# EAGLE design OSO-BOOK-C1-00 (EAGLE 9.6.2)

## Sheet 1 of 2
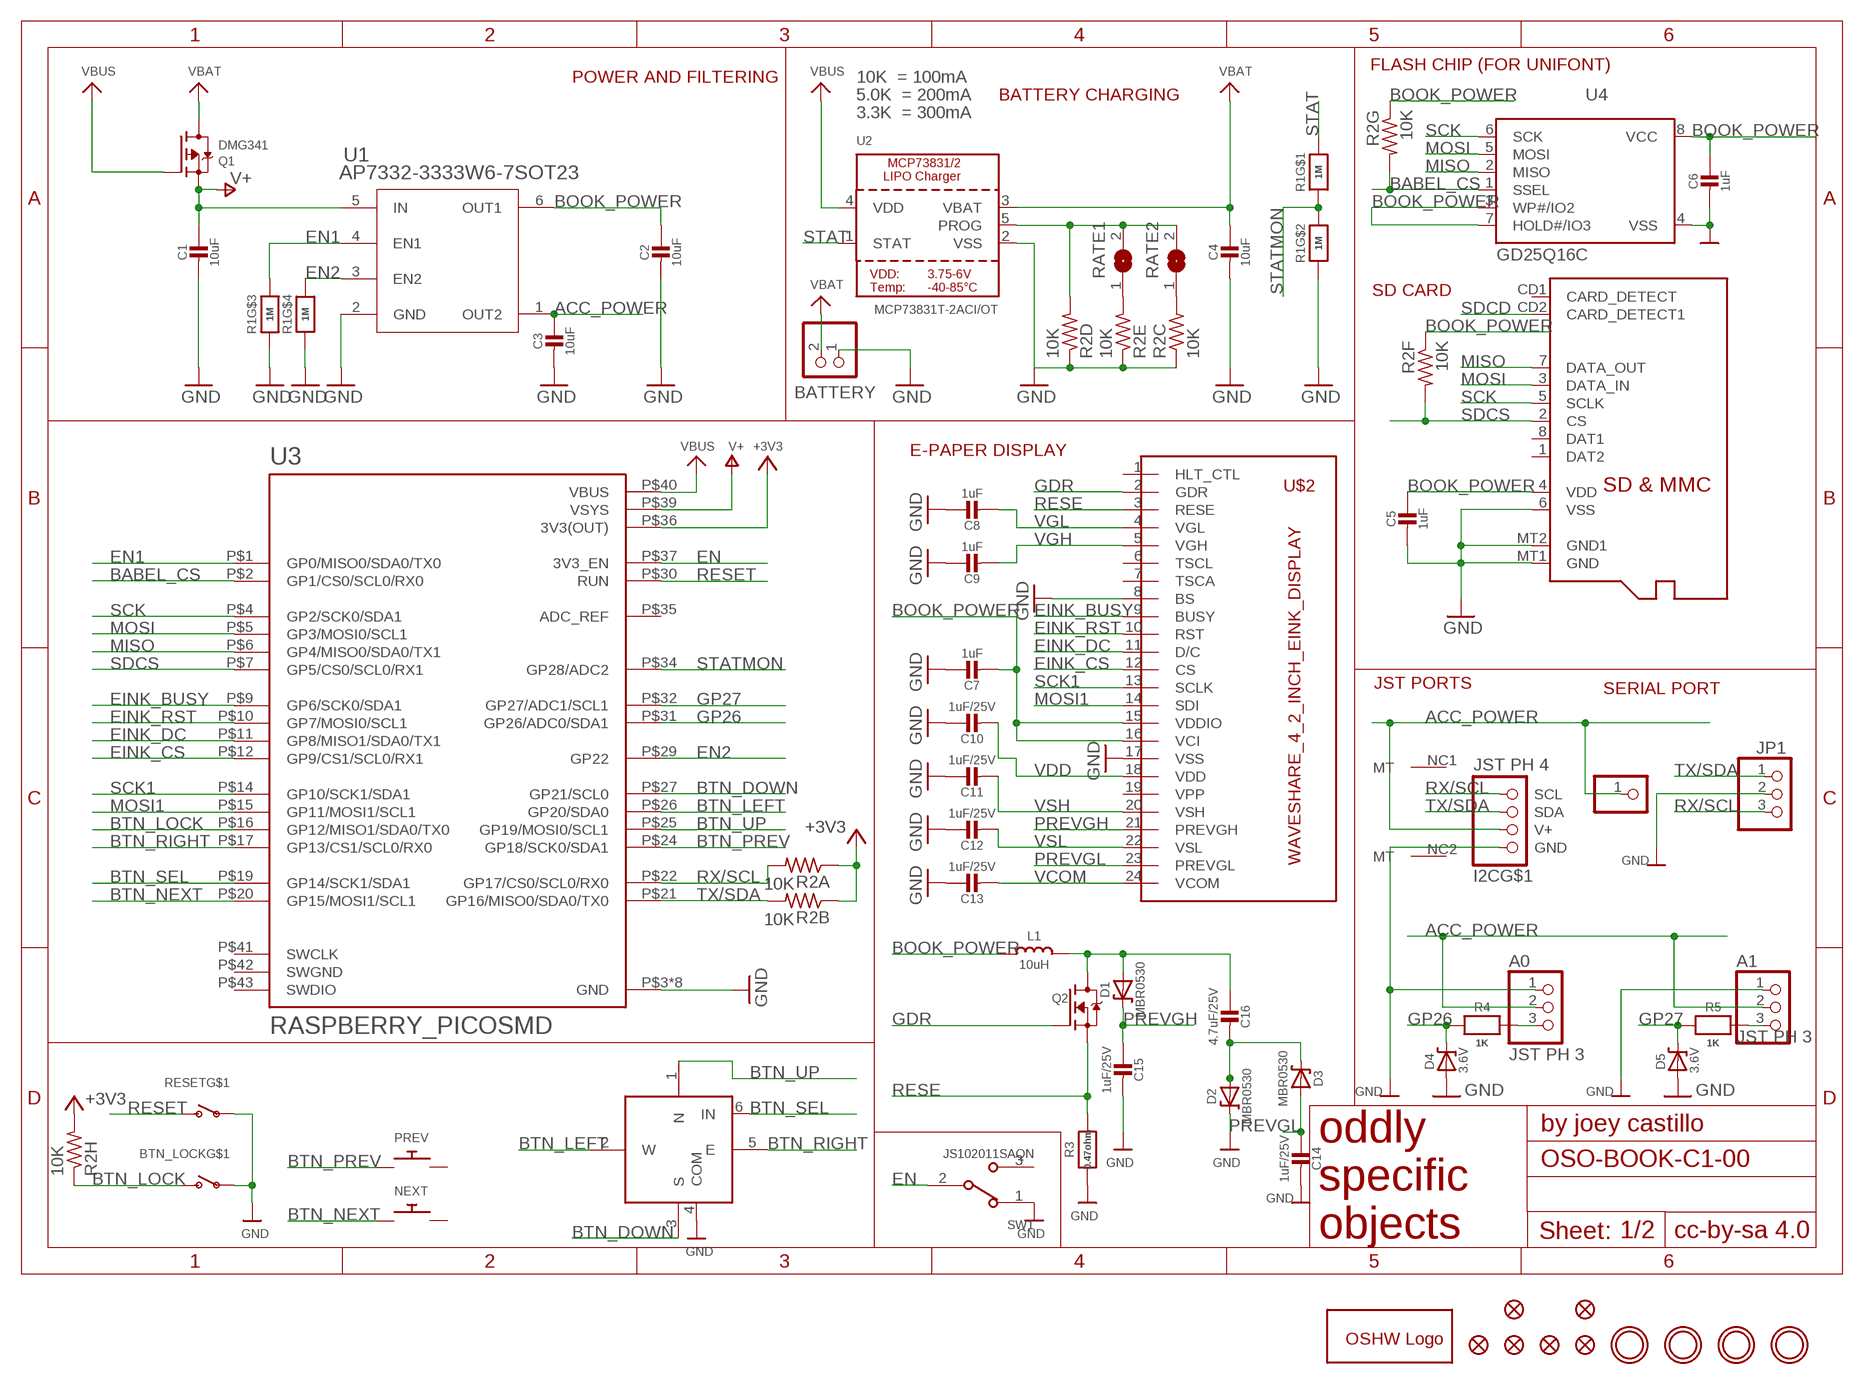
[diagram p0: schematic, sheet 1]

### Parts
A0  JST PH 3  CON_JST_PH_3PIN  [JSTPH3]
A1  JST PH 3  CON_JST_PH_3PIN  [JSTPH3]
BATTERY  JSTPH  CON_JST_PH_2PIN  [JSTPH2]
BTN_LOCK  SWITCH_SPSTTL3330A  [TL3330A]
C1  10uF  CAP_CERAMIC0805-NOOUTLINE  [0805-NO]
C2  10uF  CAP_CERAMIC0805-NOOUTLINE  [0805-NO]
C3  10uF  CAP_CERAMIC0805-NOOUTLINE  [0805-NO]
C4  10uF  CAP_CERAMIC0805-NOOUTLINE  [0805-NO]
C5  1uF  CAP_CERAMIC0805-NOOUTLINE  [0805-NO]
C6  1uF  CAP_CERAMIC0805-NOOUTLINE  [0805-NO]
C7  1uF  CAP_CERAMIC0805-NOOUTLINE  [0805-NO]
C8  1uF  CAP_CERAMIC0805-NOOUTLINE  [0805-NO]
C9  1uF  CAP_CERAMIC0805-NOOUTLINE  [0805-NO]
C10  1uF/25V  CAP_CERAMIC0805-NOOUTLINE  [0805-NO]
C11  1uF/25V  CAP_CERAMIC0805-NOOUTLINE  [0805-NO]
C12  1uF/25V  CAP_CERAMIC0805-NOOUTLINE  [0805-NO]
C13  1uF/25V  CAP_CERAMIC0805-NOOUTLINE  [0805-NO]
C14  1uF/25V  CAP_CERAMIC0805-NOOUTLINE  [0805-NO]
C15  1uF/25V  CAP_CERAMIC0805-NOOUTLINE  [0805-NO]
C16  4.7uF/25V  CAP_CERAMIC0805-NOOUTLINE  [0805-NO]
D1  MBR0530  DIODE-SCHOTTKYSOD-123  [SOD-123]
D2  MBR0530  DIODE-SCHOTTKYSOD-123  [SOD-123]
D3  MBR0530  DIODE-SCHOTTKYSOD-123  [SOD-123]
D4  3.6V  DIODE-ZENERSOD123  [SOD-123]
D5  3.6V  DIODE-ZENERSOD123  [SOD-123]
FID1  FIDUCIAL_1MM  [FIDUCIAL_1MM]
FID2  FIDUCIAL_1MM  [FIDUCIAL_1MM]
FID3  FIDUCIAL_1MM  [FIDUCIAL_1MM]
FID4  FIDUCIAL_1MM  [FIDUCIAL_1MM]
FID5  FIDUCIAL_1MM  [FIDUCIAL_1MM]
FID6  FIDUCIAL_1MM  [FIDUCIAL_1MM]
GOLD_ORB_SM1  OSHWLOGOLOGO5MM  [OSHW_5MM]
I2C  JST PH 4  STEMMA_I2C_RASMT  [JSTPH4]
JP1  PINHD-1X3  [1X03]
JP2  PINHD-1X1  [1X01]
L1  10uH  MICROBUILDER_INDUCTORNR401_BIGPADS  [MICROBUILDER_INDUCTOR_4X4MM_NR401_BIGPADS]
MICROSD  MICROSD  [MICROSD]
NEXT  SWITCH_PUSHBUTTON_3.5X6MM  [TACTILE_3X6MM]
PREV  SWITCH_PUSHBUTTON_3.5X6MM  [TACTILE_3X6MM]
Q1  DMG341  MOSFET-P  [SOT23-R]
Q2  IRLML0100  IRLML2060TRPBF  [SOT23-3]
R1  1M  EXB-V8V103JV-GOOD  [EXBV8V]
R2  10K  EXB-2HV470JV  [EXB2HV]
R3  0.47ohm  RESISTOR0805_NOOUTLINE  [0805-NO]
R4  1K  RESISTOR0805_NOOUTLINE  [0805-NO]
R5  1K  RESISTOR0805_NOOUTLINE  [0805-NO]
RATE1  SOLDERJUMPER  [SOLDERJUMPER_ARROW_NOPASTE]
RATE2  SOLDERJUMPER  [SOLDERJUMPER_ARROW_NOPASTE]
RESET  SWITCH_SPSTTL3330A  [TL3330A]
SW1  JS102011SAQN  [SW_JS102011SAQN]
SW3  NAVSWITCHSKQUABAUE010  [SKQUBAE010]
U1  AP7332-3333W6-7SOT23  [SOT23-6]
U2  MCP73831T-2ACI/OT  MCP73831/2  [SOT23-5]
U3  RASPBERRY_PICOSMD  [PICO-PKG-SMD]
U4  GD25Q16C  MICROBUILDER_SPIFLASH_SOIC8  [MICROBUILDER_SOIC8_150MIL]
U$1  MOUNTINGHOLE2.5  [MOUNTINGHOLE_2.5_PLATED]
U$2  WAVESHARE_4_2_INCH_EINK_DISPLAY  [EINK_DISPLAY_4_2IN]
U$4  MOUNTINGHOLE2.5  [MOUNTINGHOLE_2.5_PLATED]
U$5  MOUNTINGHOLE2.5  [MOUNTINGHOLE_2.5_PLATED]
U$7  MOUNTINGHOLE2.5  [MOUNTINGHOLE_2.5_PLATED]

### Nets
+3V3: R2.1 R2.2 R2.9 U3.P$36(3V3(OUT))
_GP26: A0.3 R4.1
_GP27: A1.3 R5.1
ACC_POWER [power]: A0.2 A1.2 C3.1 I2C.2(V+) JP2.1 U1.1(OUT2)
BABEL_CS: R2.10 U3.P$2(GP1/CS0/SCL0/RX0) U4.1(SSEL)
BOOK_POWER [power]: C2.1 C5.1 C6.1 C7.2 L1.P$1 MICROSD.4(VDD) R2.6 R2.7 U1.6(OUT1) U4.3(WP#/IO2) U4.7(HOLD#/IO3) U4.8(VCC) U$2.15(VDDIO) U$2.16(VCI)
BTN_DOWN: SW3.3(S) U3.P$27(GP21/SCL0)
BTN_LEFT: SW3.2(W) U3.P$26(GP20/SDA0)
BTN_LOCK: BTN_LOCK.P$2(S) R2.8 U3.P$16(GP12/MISO1/SDA0/TX0)
BTN_NEXT: NEXT.P$1 U3.P$20(GP15/MOSI1/SCL1)
BTN_PREV: PREV.P$1 U3.P$24(GP18/SCK0/SDA1)
BTN_RIGHT: SW3.5(E) U3.P$17(GP13/CS1/SCL0/RX0)
BTN_SEL: SW3.6(IN) U3.P$19(GP14/SCK1/SDA1)
BTN_UP: SW3.1(N) U3.P$25(GP19/MOSI0/SCL1)
EINK_BUSY: U3.P$9(GP6/SCK0/SDA1) U$2.9(BUSY)
EINK_CS: U3.P$12(GP9/CS1/SCL0/RX1) U$2.12(CS)
EINK_DC: U3.P$11(GP8/MISO1/SDA0/TX1) U$2.11(D/C)
EINK_RST: U3.P$10(GP7/MOSI0/SCL1) U$2.10(RST)
EN: SW1.2 U3.P$37(3V3_EN)
EN1: R1.3 U1.4(EN1) U3.P$1(GP0/MISO0/SDA0/TX0)
EN2: R1.4 U1.3(EN2) U3.P$29(GP22)
GDR: Q2.1(G) U$2.2(GDR)
GND [gnd]: A0.1 A1.1 BATTERY.1 BTN_LOCK.P$1(P) C1.2 C2.2 C3.2 C4.2 C5.2 C6.2 C7.1 C8.1 C9.1 C10.1 C11.1 C12.1 C13.1 C14.2 C15.2 D2.C D4.A D5.A I2C.1(GND) JP1.2 MICROSD.6(VSS) MICROSD.MT1(GND) MICROSD.MT2(GND1) R1.2 R1.5 R1.6 R2.3 R2.4 R2.5 R3.2 RESET.P$1(P) SW1.1 SW3.4(COM) U1.2(GND) U2.2(VSS) U3.P$3(GND) U3.P$8(GND) U3.P$13(GND) U3.P$18(GND) U3.P$23(GND) U3.P$28(GND) U3.P$33(GND) U3.P$38(GND) U4.4(VSS) U$2.8(BS) U$2.17(VSS)
GP26: D4.C R4.2 U3.P$31(GP26/ADC0/SDA1)
GP27: D5.C R5.2 U3.P$32(GP27/ADC1/SCL1)
MISO: MICROSD.7(DATA_OUT) U3.P$6(GP4/MISO0/SDA0/TX1) U4.2(MISO)
MOSI: MICROSD.3(DATA_IN) U3.P$5(GP3/MOSI0/SCL1) U4.5(MOSI)
MOSI1: U3.P$15(GP11/MOSI1/SCL1) U$2.14(SDI)
N$1: R2.12 RATE1.1
N$2: C16.2 D2.A D3.C
N$3: C16.1 D1.A L1.P$2 Q2.3(D)
N$4: R2.14 RATE2.1
PREVGH: C15.1 D1.C U$2.21(PREVGH)
PREVGL: C14.1 D3.A U$2.23(PREVGL)
PROG: R2.13 RATE1.2 RATE2.2 U2.5(PROG)
RESE: Q2.2(S) R3.1 U$2.3(RESE)
RESET: RESET.P$2(S) U3.P$30(RUN)
RX/SCL: I2C.4(SCL) JP1.3 R2.16 U3.P$22(GP17/CS0/SCL0/RX0)
SCK: MICROSD.5(SCLK) U3.P$4(GP2/SCK0/SDA1) U4.6(SCK)
SCK1: U3.P$14(GP10/SCK1/SDA1) U$2.13(SCLK)
SDCD: MICROSD.CD2(CARD_DETECT1)
SDCS: MICROSD.2(CS) R2.11 U3.P$7(GP5/CS0/SCL0/RX1)
STAT [power]: R1.8 U2.1(STAT)
STATMON: R1.1 R1.7 U3.P$34(GP28/ADC2)
TX/SDA: I2C.3(SDA) JP1.1 R2.15 U3.P$21(GP16/MISO0/SDA0/TX0)
V+ [power]: C1.1 Q1.2(S) U1.5(IN) U3.P$39(VSYS)
VBAT [power]: BATTERY.2 C4.1 Q1.3(D) U2.3(VBAT)
VBUS [power]: Q1.1(G) U2.4(VDD) U3.P$40(VBUS)
VCOM: C13.2 U$2.24(VCOM)
VDD: C10.2 U$2.18(VDD)
VGH: C9.2 U$2.5(VGH)
VGL: C8.2 U$2.4(VGL)
VSH: C11.2 U$2.20(VSH)
VSL: C12.2 U$2.22(VSL)
Unconnected: BTN_LOCK.P$3(MT) BTN_LOCK.P$4(MT) I2C.NC1(MT) I2C.NC2(MT) MICROSD.1(DAT2) MICROSD.8(DAT1) MICROSD.CD1(CARD_DETECT) NEXT.P$2 PREV.P$2 RESET.P$3(MT) RESET.P$4(MT) SW1.3 U3.P$35(ADC_REF) U3.P$41(SWCLK) U3.P$43(SWDIO) U$2.1(HLT_CTL) U$2.6(TSCL) U$2.7(TSCA) U$2.19(VPP)

### Notes on the sheet
- FLASH CHIP (FOR UNIFONT)
- POWER AND FILTERING | 10K  = 100mA
- 5.0K  = 200mA | BATTERY CHARGING
- 3.3K  = 300mA
- SD CARD
- E-PAPER DISPLAY
- JST PORTS
- SERIAL PORT

## Sheet 2 of 2
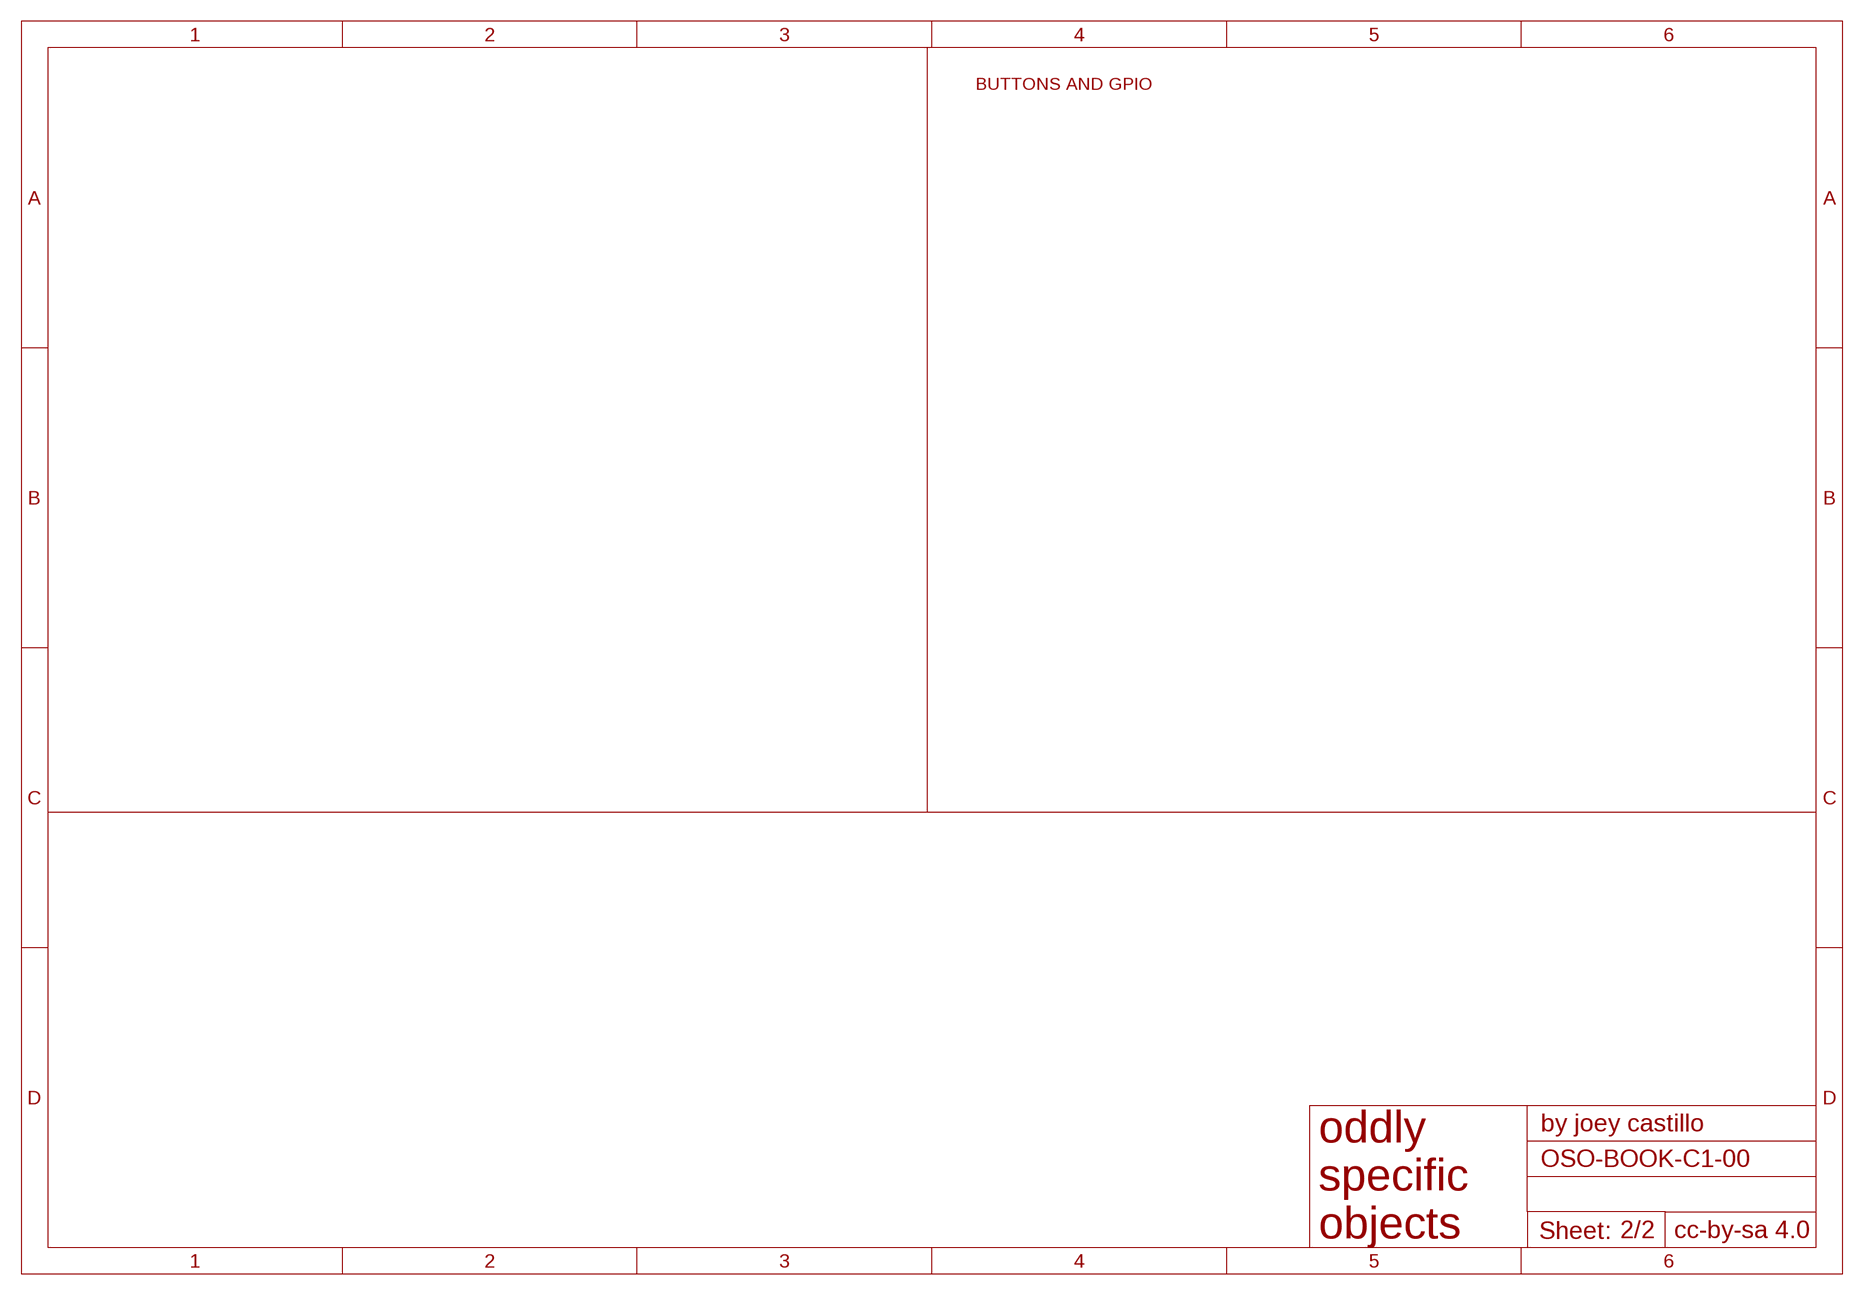
[diagram p1: schematic, sheet 2]

### Notes on the sheet
- BUTTONS AND GPIO

## Power pins joined to a net without a drawn wire
SWGND: U3.P$42(SWGND)

## Library data of the parts
A0 A1 = microbuilder:CON_JST_PH_3PIN
BATTERY = microbuilder:CON_JST_PH_2PIN: JST 2-Pin Right-Angle Connector PH-Series - 4UConnector: 17311 SH-Series - 4UConnector: 07278
BTN_LOCK RESET = oddlyspecific:SWITCH_SPST: Switch - SPST 4UCon 19192 (6.7x2.6mm SMT)
C1-C16 = microbuilder:CAP_CERAMIC: Ceramic Capacitors For new designs, use the packages preceded by an '_' character since they are more reliable: The following footprints should be used on most boards: _0402 - Standard footprint for regular board layouts _0603 - Standard footprint for regular board layouts _0805 - Standard footprint for regular board layouts _1206 - Standard footprint for regular board layouts For extremely tight-pitch boards where space is at a premium, the following 'micro-pitch' footprints can be used (smaller pads, no silkscreen outline, etc.): _0402MP - Micro-pitch footprint for very dense/compact boards _0603MP - Micro-pitch footprint for very dense/compact boards _0805MP - Micro-pitch footprint for very dense/compact boards _1206MP - Micro-pitch footprint for very dense/compact boards
D1-D3 = microbuilder:DIODE-SCHOTTKY
D4 D5 = microbuilder:DIODE-ZENER: Zener Diode SMA: 30V 1W Zener Diode, 1.2Vf - Digikey: SMAZ30-FDICT-ND
FID1-FID6 = microbuilder:FIDUCIAL: Fiducial Alignment Points Various fiducial points for machine vision alignment.; BOM: EXCLUDE
GOLD_ORB_SM1 = oshw:OSHWLOGO: The OSHW logo for PCB layout
I2C = microbuilder:STEMMA_I2C
JP1 = adafruit:PINHD-1X3: PIN HEADER
JP2 = adafruit:PINHD-1X1: Pin header 1x1 for 0.1" spacing With round pins
L1 = Adafruit 3.5in 480x320 FeatherWing:MICROBUILDER_INDUCTOR: Inductors 0603: 10nH Ceramic Inductor - microwire antenna/RF (Digikey: 712-1434-2-ND) 0805: 560nH Ceramic Inductor - RF (Digikey: 553-1047-1-ND) 270nH Ceramic Inductor - Q = 40@250MHz, +-5%, 1 Ohm DC Resistance (Digikey: 535-10506-2-ND) 1007 (2518 Metric) SMT: 10µH 10% 250mOhm 820mA 1007 Inductor (Digikey: 587-2189-1-ND) 22µH 10% 500mOhm 580mA 1007 Inductor (Digikey: 587-2190-1-ND) 47µH 10% 950mOhm 420mA 1007 Inductor (Digikey: 587-2191-1-ND) 47µH 5% 100mOhm 1A 1008 Inductor (Digikey: 732-1816-1-ND) 5.0x5.0mm (Taiyo Yuden NR5040 Series) 6.8µH 20% 2.3A 64mOhm Inductor (Digikey: 587-2374-2-ND) 5.0x5.0mm (TDK VLC5045 Series) 4.7µH 20% 3.3A 34mOhm Inductor (Digikey: 445-6526-1-ND) 6.8µH 20% 2.7A 46mOhm Inductor (Digikey: 445-6527-1-ND) 6.0x6.0mm (TDK VLC6045 Series) 4.7µH 20% 3.8A 27mOhm Inductor (Digikey: 445-6538-2-ND) 6.8µH 20% 3A 41mOhm Inductor (Digikey: 445-6540-1-ND) 6.2µH 30% 2.2A 45mOhm Inductor (Digikey: SRR5028-6R2YCT-ND) - Not TDK VLC6045 but footprint should match 6.0x6.0mm (TDK SLF6045 Series) 6.8uH 30% 2A 33mOhm Inductor (Digikey: 445-4572-1-ND, Mouser: 810-SLF645T6R8N2R0PF) 6.0x6.0mm (Sumida CDRH5D28 Series) 6.2uH 30% 1.8A 45mOhm Inductor (Digikey: 308-1542-1-ND) Taiyo Yuden NR3015T2R2M - 2.2uH 20% 1.5A (Digikey: 587-1648-2-ND, Mouser: 963-NR3015T2R2M) - Used with TI TPS62172 CoilCraft RFID Transponder Coil - MA5532-AE (For use with AS3935 Lightning Sensor) Taiyo Yuden NRH2412T2R2MNGH - 2.2uH 20% 1AA (Digikey: 587-3443-1-ND) - Used with TI LM3671 Vishay IHLP 1.0uH Molded Inductor - 24mOhm DCR, 5A, +/-20%, -55°C-125°C (Digikey: 541-1319-1-ND)
MICROSD = adafruit:MICROSD: Micro-SD / Transflash card holder with SPI pinout For the 3M # 2908-05WB-MG and/or 4UCON #19656 push-push type
NEXT PREV = microbuilder:SWITCH_PUSHBUTTON: Buttons SOFTTOUCHSMD_SJ - Soft touch temporary push button (Super Junk Akihabara) Compatible with SKPMANE010 [Mouser: 688-SKPMAN] C&K_KSS = Digikey: KSS221GLFS
Q1 = microbuilder:MOSFET-P: P-Channel Mosfet LEGEND VDS: Voltage Drain-Source ID: Drain Current RDS(ON): Drain-Source On-State Resistance VGS(TH): Gate-Source Threshold Voltage CISS: Drain-Source Input Capacitance SOT-23 Name VDS ID RDS(ON) VGS(TH) CISS Order Number IRLML5103 30V 760mA 600 mOhm -- 75pF @ 25V Digikey: IRLML5103PBFCT-ND IRLML6401 12V 4.3A 50 mOhm 950mV @ 250µA 830pF @ 10V Digikey: IRLML6401PBFTR-ND NTR0202PL 20V 400mA 800 mOhm 2.3V @ 250uA 70pF @ 5V Digikey: NTR0202PLT1GOSTR-ND NTR4101PT1G 20V 1.8A 85 mOhm 1.2V @ 250uA 675pF @ 10V Digikey: NTR4101PT1GOSCT-ND DMP2004K 20V 600mA 900 mOhm 1V @ 250uA 175pF @ 16V Digikey: DMP2004KDICT-ND PMV65XP 20V 3.9A 76 mOhm 950mV @ 1mA 725pF @ 20V Digikey: 568-2358-2-ND TO-252 Name VDS ID RDS(ON) VGS(TH) CISS Order Number AOD417 30V 25A 34 mOhm 3V @ 250µA 920pF @ 15V Digikey: 785-1106-2-ND PowerPak Name VDS ID RDS(ON) VGS(TH) CISS Order Number AON7401 30V 12A 14 mOhm 3V @ 250µA 2600pF @ 15V Digikey: 785-1302-1-ND
Q2 = Parts:IRLML2060TRPBF
R1 = resistor array:EXB-V8V103JV-GOOD; MANUFACTURER_PART_NUMBER: EXBV8V103JV; VENDOR: Panasonic
R2 = EXB2HV470JV:EXB-2HV470JV; BUILT_BY: EMA_UL_Team; MANUFACTURER_PART_NUMBER: EXB-2HV470JV; VENDOR: Panasonic
R3-R5 = microbuilder:RESISTOR: Resistors For new designs, use the packages preceded by an '_' character since they are more reliable: The following footprints should be used on most boards: _0402 - Standard footprint for regular board layouts _0603 - Standard footprint for regular board layouts _0805 - Standard footprint for regular board layouts _1206 - Standard footprint for regular board layouts For extremely tight-pitch boards where space is at a premium, the following 'micro-pitch' footprints can be used (smaller pads, no silkscreen outline, etc.): _0402MP - Micro-pitch footprint for very dense/compact boards _0603MP - Micro-pitch footprint for very dense/compact boards _0805MP - Micro-pitch footprint for very dense/compact boards _1206MP - Micro-pitch footprint for very dense/compact boards
RATE1 RATE2 = microbuilder:SOLDERJUMPER: SMD Solder JUMPER Solder the two pads together to create a connection, or remove the solder to break it. REFLOW - Use this footprint for solder paste and reflow ovens. WAVE - Use this footprint for hand-soldering (larger pads). CLOSED - Has a trace between the two pads to ensure it is closed by default. The trace needs to be cut to disable the jumper, and can be closed again by creating a solder bridge between the two pads.; BOM: EXCLUDE
SW1 = JS102011SAQN:JS102011SAQN: JS10 Series SPDT On-On 6 V 0.3 A Gull Wing SMT Slide Switch http://www.snapeda.com/parts/JS102011SAQN/C%26K%20Components/view-part/; DESCRIPTION: Slide Switch SPDT Surface Mount, Right Angle; DIGI-KEY_PART_NUMBER: 401-1999-1-ND; DIGI-KEY_PURCHASE_URL: https://www.digikey.com/product-detail/en/c-k/JS102011SAQN/401-1999-1-ND/1640114?utm_source=snapeda&utm_medium=aggregator&utm_campaign=symbol; MF: C&K; MP: JS102011SAQN; PACKAGE: None
SW3 = microbuilder:NAVSWITCH
U1 = My Stuff:AP7332-3333W6-7
U2 = microbuilder:MCP73831/2: MCP73831/2 LIPO Charger VDD: 3.75 - 6V Temp -40 - 85°C Programmable Charge Rate: 15-500mA NOTE: STAT is a tri-state logic output on the MCP73831 and an open-drain output on the MCP73832. SOT23-5 with 4.2V output and tri-state logic on STAT = MCP73831T-2ACI/OT
U3 = RpiPico:RASPBERRY_PICO: Raspberry Pi Pico
U4 = Adafruit Feather M0 Express:MICROBUILDER_SPIFLASH_SOIC8: SOIC8 SPI Flash Be careful with the size since SOIC8 flash comes in several 'widths' SOIC8 150 mil M25P16 - 16Mbit (2Mbit x 8) Serial Flash (75MHz SPI Bus), Supply: 2.7-3.6V Digikey: SOIC8 - M25P16-VMN6P-ND SOIC8 208 mil W25Q16BVSSIG - 16Mbit (2Mbit x 8) Serial Flash (104MHz SPI Bus), Supply: 2.7-3.6V Digikey: SOIC8 - W25Q16BVSSIG-ND
U$1 U$4 U$5 U$7 = microbuilder:MOUNTINGHOLE: Mounting Hole For #2 screws (0.086"/2.18mm width, 0.094"/2.4mm hole) use 2.5mm; BOM: EXCLUDE
U$2 = My Stuff:WAVESHARE_4_2_INCH_EINK_DISPLAY

## Net classes
0 default: width 0.152 mm, drill 0.254 mm
1 power: width 0.254 mm, drill 0.254 mm
2 gnd: width 0.305 mm, drill 0.305 mm

## Board
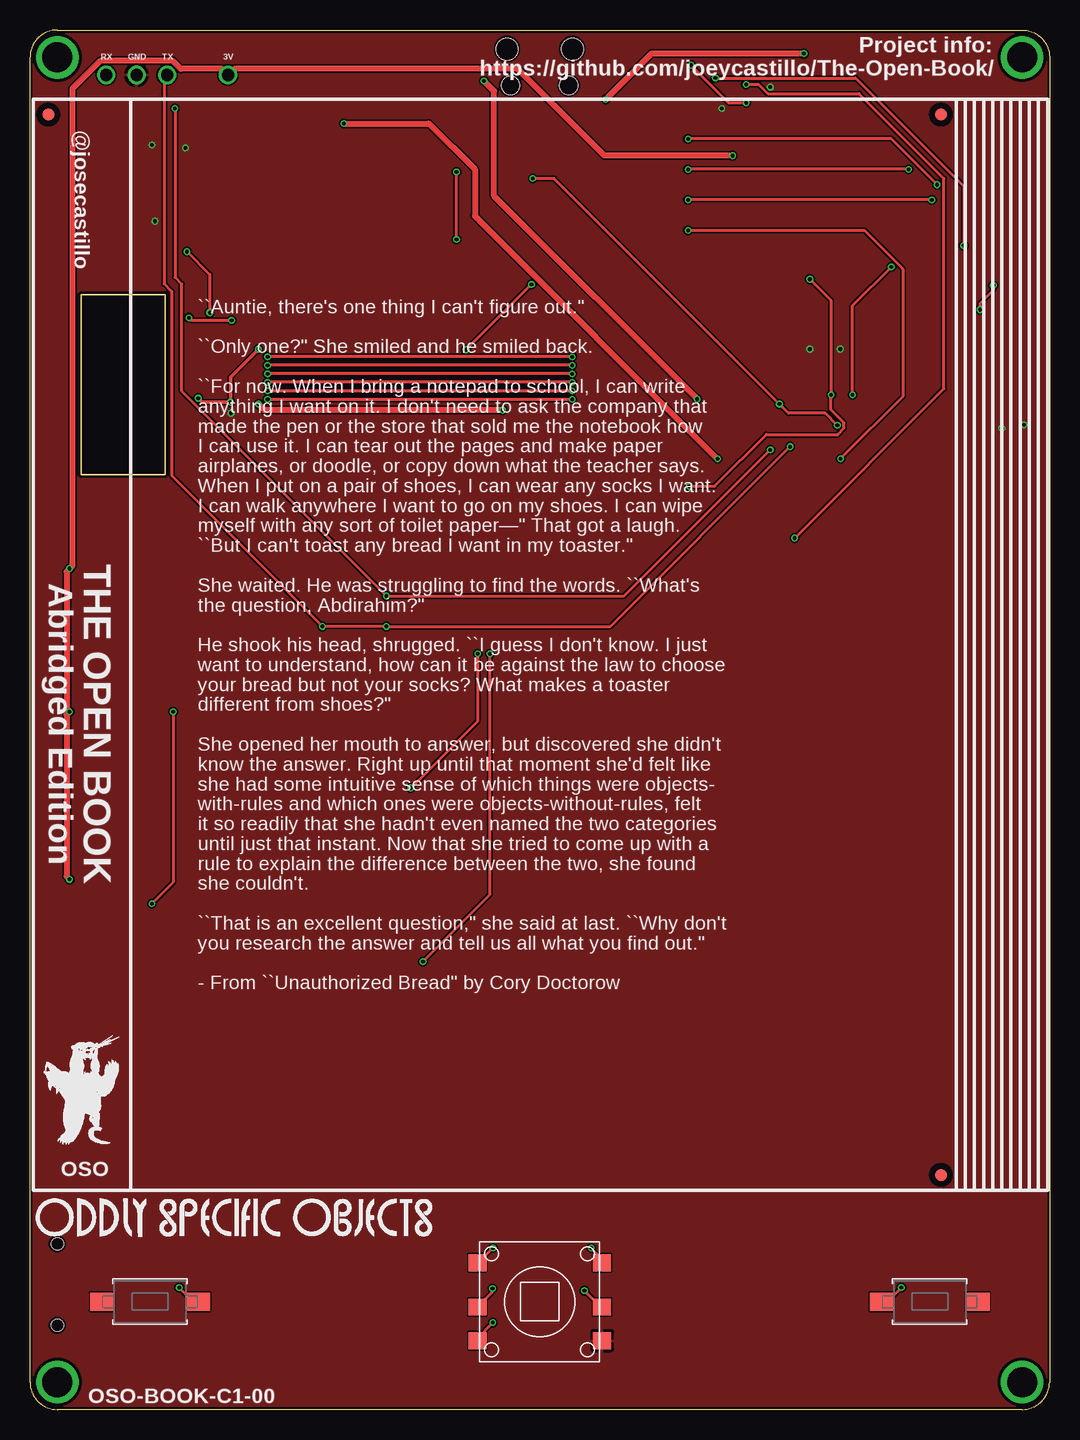
[diagram p2: board, top side]
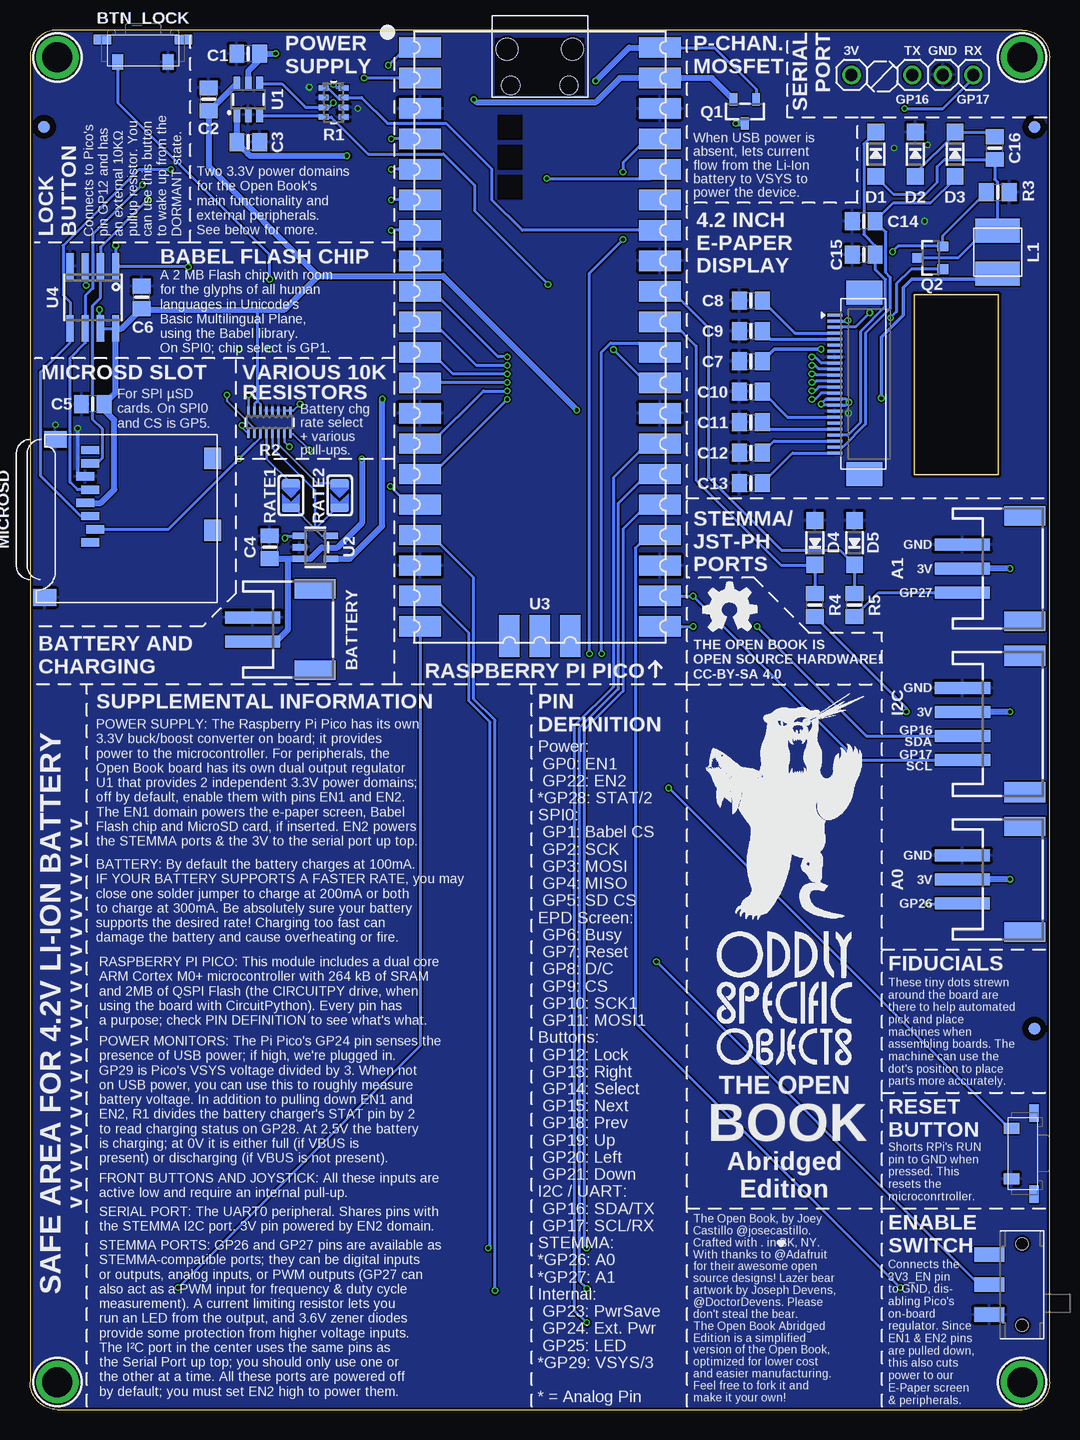
[diagram p3: board, bottom side, seen from below]

Size 85 x 115 mm. Coordinates in mm from the lower left corner, seen from the top.
Outline: 2.29,115 82.71,115 arc-90 85,112.71 85,2.29 arc-90 82.71,0 2.29,0 arc-90 0,2.29 0,112.71 arc-90 2.29,115
Copper layers (1*16): Top 0.035559375mm / dielectric 1.6mm / Bottom 0.035559375mm
Design rules "jlcpcb2layer *": minimum track width 5mil, minimum drill 12mil, track to track 5mil, track to pad 5mil, pad to pad 5mil, via to via 5mil, smd to smd 5mil, copper to edge 8mil, drill to drill 6mil, minimum pad ring 5mil, minimum via ring 5mil, stop-mask expansion 2.5mil, vias tented up to drill 20mil, thermal gap 10mil
bKeepout: area -56,-78 to -6,-18; area 89,-143.7 to 125,-83.7; area -1,-78 to 69,-18; area 75,-78 to 125,-18; area 42,-135 to 84,-84
bRestrict: area 58.4,76.5 to 58.4,76.6; area 64,76.5 to 64.1,76.6

### Footprints (pad centres in the part's own frame; a part is rotated, then mirrored left to right if it is on the bottom)
JSTPH3 = smd 1 x 4.6: 1 -2,-2.7; 2 0,-2.7; 3 2,-2.7 | smd 1.6 x 3.4: NC1 -4.4,2.5; NC2 4.4,2.5
JSTPH2 = smd 1 x 4.6: 1 -1,-3.7; 2 1,-3.7 | smd 1.6 x 3.4: NC1 -3.4,1.5; NC2 3.4,1.5
TL3330A = smd 0.9 x 1.27: P$1 -2.1,0.89; P$2 2.1,0.89 | smd 1.45 x 0.8: P$3 -3.375,-1; P$4 3.375,-1
0805-NO = smd 1.24 x 1.5: 1 -0.95,0; 2 0.95,0
SOD-123 = smd 1.4 x 1.4: A 1.85,0; C -1.85,0
FIDUCIAL_1MM = smd 1 x 1: 1 0,0
JSTPH4 = smd 1 x 4.6: 1 -3,-3.7; 2 -1,-3.7; 3 1,-3.7; 4 3,-3.7 | smd 1.7 x 3.4: NC1 -5.7,1.5; NC2 5.7,1.5
1X03 = drill 1.016: 1 -2.54,0; 2 0,0; 3 2.54,0
1X01 = drill 1.016: 1 0,0
MICROBUILDER_INDUCTOR_4X4MM_NR401_BIGPADS = smd 2 x 3.7: P$1 -1.8,0; P$2 1.8,0
MICROSD = smd 0.7 x 1.5: 1 9,-10.64; 2 7.9,-10.24; 3 6.8,-10.64; 4 5.7,-11.04; 5 4.6,-10.64; 6 3.5,-11.04; 7 2.4,-10.64; 8 1.3,-10.64 | smd 1.8 x 1.4: CD1 2,-0.44; CD2 8,-0.44 | smd 1.4 x 1.9: MT1 0.4,-13.54; MT2 13.6,-14.44
TACTILE_3X6MM = smd 2 x 1.5: P$1 -4,0; P$2 4,0
SOT23-R = smd 0.635 x 1.016: 1 -0.95,-1; 2 0.95,-1; 3 0,1
SOT23-3 = smd 0.8 x 0.9: 1 -0.95,-1; 2 0.95,-1; 3 0,1.1
EXBV8V = smd 0.838 x 0.457: 1 -0.838,1.219; 2 -0.838,0.406; 3 -0.838,-0.406; 4 -0.838,-1.219; 5 0.838,-1.219; 6 0.838,-0.406; 7 0.838,0.406; 8 0.838,1.219
EXB2HV = smd 0.686 x 0.203: 1 -0.965,1.75; 2 -0.965,1.25; 3 -0.965,0.75; 4 -0.965,0.25; 5 -0.965,-0.25; 6 -0.965,-0.75; 7 -0.965,-1.25; 8 -0.965,-1.75; 9 0.965,-1.75; 10 0.965,-1.25; 11 0.965,-0.75; 12 0.965,-0.25; 13 0.965,0.25; 14 0.965,0.75; 15 0.965,1.25; 16 0.965,1.75
SOLDERJUMPER_ARROW_NOPASTE = smd 0.762 x 1.524: 1 -1.016,0; 2 1.016,0
SW_JS102011SAQN = smd 1.2 x 2.5: 1 -2.5,2.75; 2 0,2.75; 3 2.5,2.75 | hole 1: -3.4,0; 3.4,0
SKQUBAE010 = smd 1.5 x 1.4: 1 -5.2,3.25; 2 -5.2,-0.45; 3 -5.2,-3.25; 4 5.2,-3.25; 5 5.2,-0.45; 6 5.2,3.25
SOT23-6 = smd 0.55 x 1.2: 1 0.95,1.3; 2 0,1.3; 3 -0.95,1.3; 4 -0.95,-1.3; 5 0,-1.3; 6 0.95,-1.3
SOT23-5 = smd 0.55 x 1.2: 1 -0.95,-1.3; 2 0,-1.3; 3 0.95,-1.3; 4 0.95,1.3; 5 -0.95,1.3
PICO-PKG-SMD = smd 3.5 x 1.7: P$1 -10,24.13; P$2 -10,21.59; P$3 -10,19.05; P$4 -10,16.51; P$5 -10,13.97; P$6 -10,11.43; P$7 -10,8.89; P$8 -10,6.35; P$9 -10,3.81; P$10 -10,1.27; P$11 -10,-1.27; P$12 -10,-3.81; P$13 -10,-6.35; P$14 -10,-8.89; P$15 -10,-11.43; P$16 -10,-13.97; P$17 -10,-16.51; P$18 -10,-19.05; P$19 -10,-21.59; P$20 -10,-24.13; P$21 10,-24.13; P$22 10,-21.59; P$23 10,-19.05; P$24 10,-16.51; P$25 10,-13.97; P$26 10,-11.43; P$27 10,-8.89; P$28 10,-6.35; P$29 10,-3.81; P$30 10,-1.27; P$31 10,1.27; P$32 10,3.81; P$33 10,6.35; P$34 10,8.89; P$35 10,11.43; P$36 10,13.97; P$37 10,16.51; P$38 10,19.05; P$39 10,21.59; P$40 10,24.13 | smd 1.7 x 3.5: P$41 -2.54,-24.925; P$42 0,-24.925; P$43 2.54,-24.925 | hole 1.8: -2.725,24; 2.725,24 | hole 1.5: -2.425,20.97; 2.425,20.97
MICROBUILDER_SOIC8_150MIL = smd 0.6 x 2.2: 1 -1.905,-2.6; 2 -0.635,-2.6; 3 0.635,-2.6; 4 1.905,-2.6; 5 1.905,2.6; 6 0.635,2.6; 7 -0.635,2.6; 8 -1.905,2.6
MOUNTINGHOLE_2.5_PLATED = drill 2.5 pad 3.2: P$1 0,0
EINK_DISPLAY_4_2IN = smd 1.25 x 0.275 bottom: 1 17.653,-16.717; 2 17.653,-17.217; 3 17.653,-17.717; 4 17.653,-18.217; 5 17.653,-18.717; 6 17.653,-19.217; 7 17.653,-19.717; 8 17.653,-20.217; 9 17.653,-20.717; 10 17.653,-21.217; 11 17.653,-21.717; 12 17.653,-22.217; 13 17.653,-22.717; 14 17.653,-23.217; 15 17.653,-23.717; 16 17.653,-24.217; 17 17.653,-24.717; 18 17.653,-25.217; 19 17.653,-25.717; 20 17.653,-26.217; 21 17.653,-26.717; 22 17.653,-27.217; 23 17.653,-27.717; 24 17.653,-28.217 | smd 3 x 2 bottom: SPRT1 15.193,-14.867; SPRT2 15.193,-29.977

### Placement (x,y rotation side)
A0  4.57,44.2 270 bottom
A1  4.57,70.1 270 bottom
BATTERY  62.74,65.02 270 bottom
BTN_LOCK  75.58,113.22 180 bottom
C1  66.8,113.03 180 bottom
C2  70.1,109.22 90 bottom
C3  66.8,105.66 0 bottom
C4  65.02,71.88 90 bottom
C5  79.76,83.82 180 bottom
C6  75.69,92.71 90 bottom
C7  24.89,87.38 0 bottom
C8  24.89,92.46 0 bottom
C9  24.89,89.92 0 bottom
C10  24.89,84.84 0 bottom
C11  24.89,82.3 0 bottom
C12  24.89,79.76 0 bottom
C13  24.89,77.22 0 bottom
C14  15.49,99.06 180 bottom
C15  15.49,96.27 180 bottom
C16  4.57,105.16 90 bottom
D1  14.48,104.65 270 bottom
D2  11.18,104.65 270 bottom
D3  7.87,104.65 270 bottom
D4  19.56,72.26 90 bottom
D5  16.26,72.26 90 bottom
FID1  83.82,106.93 0 bottom
FID2  75.95,19.56 0 top
FID3  1.27,106.93 0 bottom
FID4  75.95,107.95 0 top
FID5  1.27,31.75 0 bottom
FID6  1.52,107.95 0 top
GOLD_ORB_SM1  26.67,66.67 0 bottom
I2C  3.56,57.15 270 bottom
JP1  8.89,111.25 0 bottom
JP2  16.51,111.25 0 bottom
L1  4.32,96.47 90 bottom
MICROSD  69.34,81.28 270 bottom
NEXT  75,9 0 top
PREV  10,9 180 top
Q1  25.4,108.2 180 bottom
Q2  9.91,96.01 90 bottom
R1  59.69,108.97 0 bottom
R2  65.02,82.3 270 bottom
R3  4.32,101.47 0 bottom
R4  19.56,67.06 90 bottom
R5  16.26,67.06 90 bottom
RATE1  63.25,76.2 270 bottom
RATE2  59.18,76.2 270 bottom
RESET  2.29,21.34 90 bottom
SW1  2.29,10.41 90 bottom
SW3  42.49,8.99 0 top
U1  66.8,109.22 180 bottom
U2  61.21,71.88 270 bottom
U3  42.49,89.41 0 bottom
U4  79.76,92.71 180 bottom
U$1  2.29,2.29 0 bottom
U$2  0.25,107.95 0 top
U$4  82.71,2.29 0 bottom
U$5  2.29,112.71 0 bottom
U$7  82.71,112.71 0 bottom
U$45  [OSO_WORDMARK_125X1300MIL_1000DPI]  0.51,16 0 top
U$47  [OSO_BEAR_525X750MIL_1000DPI]  22.1,50.29 0 bottom
U$49  [OSO_WORDMARK_THREELINE_450MIL_1000DPI]  22.1,34.29 0 bottom
U$65  [OSO_BEAR_250X360MIL_1000DPI]  4.32,26.67 0 top

### Tracks (layer width: path | path; a pad name or v marks a point on that pad's centre or on a via)
+3V3  (via drill 0.3)
  Top 0.254: v41.91,102.62 43.69,102.62 v62.48,83.82 63.25,83.06 66.3,83.06 v67.31,82.04
  Bottom 0.203: R2.2 R2.1 63.04,83.26 v62.48,83.82 | R2.9 67.31,81.87 v67.31,82.04
  Bottom 0.254: U3.P$36 33.26,102.62 v41.91,102.62
_GP26  (via drill 0.3)
  Top 0.254: v11.94,58.17 11.94,43.94 v10.16,42.16
  Bottom 0.254: R4.1 11.94,58.49 v11.94,58.17 | v10.16,42.16 7.3,42.16 A0.3
_GP27
  Bottom 0.254: R5.1 14.26,68.1 A1.3
ACC_POWER  (via drill 0.3)
  Top 0.508: v58.57,104.52 47.89,104.52 40.65,111.76 17.02,111.76 JP2.1 16,111.76 12.57,111.76 11.91,112.42 5.87,112.42 3.53,110.08 3.53,70.33 v3.3,70.1 3.05,69.85 3.05,58.42 v3.3,58.17 3.05,57.91 3.05,44.45 v3.3,44.2
  Bottom 0.508: U1.1 C3.1 66.88,104.79 66.88,104.75 66.64,104.51 58.59,104.51 v58.57,104.52 | v3.3,70.1 A1.2 | v3.3,58.17 7.24,58.17 I2C.2 | v3.3,44.2 A0.2
BABEL_CS  (via drill 0.3)
  Top 0.254: v68.58,84.58 68.58,92.01 v71.81,95.25 | v57.15,111 68.83,111 77.85,101.98 v77.85,97.03
  Bottom 0.203: R2.10 66.27,81.76 68.58,84.06 v68.58,84.58
  Bottom 0.254: v71.81,95.25 71.88,95.31 U4.1 v77.85,97.03 | U3.P$2 v57.15,111
BOOK_POWER  (via drill 0.3)
  Top 0.254: v80.31,93.71 80.31,93.31 79.2,92.2 v79.2,91.69
  Top 0.305: v14.02,84.31 14.35,83.97 v16.71,83.97 16.71,86.06 v19.05,88.39
  Top 0.508: v39.42,83.31 19.56,83.31 v19.05,83.82
  Bottom 0.203: R2.7 66.27,83.84 66.04,84.07 65.77,83.81 R2.6
  Bottom 0.254: 66.04,84.07 66.04,91.69 | v79.2,91.69 79.2,90.19 U4.7 U4.8 | U4.3 80.39,93.79 v80.31,93.71 | v19.05,83.82 19.14,83.73 U$2.16 16.95,83.73 v16.71,83.97 16.97,84.23 U$2.15 18.64,84.23 v19.05,83.82
  Bottom 0.305: L1.P$1 4.75,94.23 11.47,94.23 12.19,93.52 12.19,91.21 14.02,89.39 v14.02,84.31 | C7.2 22.93,88.39 v19.05,88.39
  Bottom 0.508: MICROSD.4 79.11,75.58 77.98,76.71 77.98,82.48 78.81,83.31 C5.1 77.85,84.78 U4.8 77.34,90.11 C6.1 75.63,91.69 66.04,91.69 63.75,91.69 60.96,94.49 | U1.6 70,108.27 C2.1 70.1,103.63 60.96,94.49 | v39.42,83.31 39.42,83.36 50.55,94.49 60.96,94.49
BTN_DOWN  (via drill 0.3)
  Top 0.254: SW3.3 37.3,5.95 v38.58,7.24
  Bottom 0.254: v38.58,7.24 39.63,8.29 39.63,56.99 36.37,60.25 36.37,77.67 33.53,80.52 U3.P$27
BTN_LEFT  (via drill 0.3)
  Top 0.254: SW3.2 38.56,9.8 v38.56,10.08
  Bottom 0.254: v38.56,10.08 39.22,10.74 39.22,56.81 35.97,60.06 35.97,75.54 33.53,77.98 U3.P$26
BTN_LOCK  (via drill 0.3)
  Top 0.254: v65.02,94.23 66.8,92.46 v66.8,84.58 66.8,84.32 66.77,84.3 66.77,83.34 67.87,82.25 67.87,81.81 67.33,81.28 61.38,81.28 57.07,76.96 v54.97,76.96
  Bottom 0.203: R2.8 66.77,84.55 v66.8,84.58
  Bottom 0.254: BTN_LOCK.P$2 77.68,108.93 65.02,96.27 v65.02,94.23 | U3.P$16 53.44,75.44 v54.97,76.96
BTN_NEXT  (via drill 0.3)
  Top 0.254: v72.64,10.16 71.48,9 NEXT.P$1
  Bottom 0.254: U3.P$20 52.49,30.31 v72.64,10.16
BTN_PREV  (via drill 0.3)
  Top 0.254: PREV.P$1 13.61,9 v12.45,10.16
  Bottom 0.254: U3.P$24 33.46,72.9 34.52,71.83 34.52,32.24 v12.45,10.16
BTN_RIGHT  (via drill 0.3)
  Top 0.254: SW3.5 47.59,8.54 v46.23,9.91
  Bottom 0.254: U3.P$17 51.56,72.9 48.01,69.34 48.01,59.25 46.23,57.47 v46.23,9.91
BTN_SEL  (via drill 0.3)
  Top 0.254: SW3.6 47.7,12.54 v46.79,13.45 v46.79,13.46
  Bottom 0.254: v46.79,13.46 46.63,13.61 46.63,57.3 48.43,59.1 48.43,64.77 51.48,67.82 U3.P$19
BTN_UP  (via drill 0.3)
  Top 0.254: SW3.1 37.38,12.24 v38.61,13.46
  Bottom 0.254: v38.61,13.46 38.81,13.66 38.81,56.64 35.56,59.89 35.56,73.41 33.53,75.44 U3.P$25
EINK_BUSY  (via drill 0.3)
  Top 0.254: v45.21,87.76 v19.81,87.76
  Bottom 0.254: U$2.9 19.04,87.23 19.57,87.76 v19.81,87.76 | v45.21,87.76 45.97,87.76 51.43,93.22 U3.P$9
EINK_CS  (via drill 0.3)
  Top 0.254: v45.21,85.63 v19.81,85.63
  Bottom 0.254: U$2.12 19.45,85.73 19.56,85.63 v19.81,85.63 | v45.21,85.63 52.47,85.63 52.47,85.62 U3.P$12
EINK_DC  (via drill 0.3)
  Top 0.254: v45.21,86.34 v19.81,86.34
  Bottom 0.254: U$2.11 19.45,86.23 19.56,86.34 v19.81,86.34 | v45.21,86.34 49.75,86.34 51.55,88.14 U3.P$11
EINK_RST  (via drill 0.3)
  Top 0.254: v45.21,87.05 v19.81,87.05
  Bottom 0.254: U$2.10 19.25,86.73 19.56,87.05 v19.81,87.05 | v45.21,87.05 47.8,87.05 51.43,90.68 U3.P$10
EN  (via drill 0.3)
  Top 0.254: v32.77,37.34 38.35,42.93 v38.35,62.99 | v35.56,97.54 v35.56,103.17
  Bottom 0.254: SW1.2 5.84,10.41 v32.77,37.34 | U3.P$37 33.58,105.92 35.56,103.94 v35.56,103.17 | v38.35,62.99 38.35,94.74 v35.56,97.54
EN1  (via drill 0.3)
  Top 0.254: v55.12,112.06 58.24,108.94 v59.7,108.94
  Bottom 0.254: U1.4 63.99,110.52 62.03,108.56 R1.3 60.08,108.56 v59.7,108.94 | v55.12,112.06 53.75,113.44 53.49,113.44 53.39,113.54 U3.P$1
EN2  (via drill 0.3)
  Top 0.254: v36.36,88.35 v41.81,93.8
  Bottom 0.254: U1.3 65.78,107.84 60.62,107.84 R1.4 59.9,107.75 56.81,104.66 50.53,104.66 47.93,102.06 47.93,99.92 v41.81,93.8 | U3.P$29 33.6,85.6 v36.36,88.35
GDR  (via drill 0.3)
  Top 0.254: v16.82,90.79 16.8,90.78 13.49,90.78 v13.26,91.01
  Bottom 0.254: U$2.2 16.88,90.73 v16.82,90.79 | Q2.1 11.53,95.06 12.75,93.84 12.75,91.52 v13.26,91.01
GND  (via drill 0.3)
  Bottom 0.305: MICROSD.6 80.67,77.78 81.04,78.15 81.04,80.46 81.03,80.47 v81.03,81.79
  other vias: 82.88,82.09 65.02,88.39 61.72,110.24 57.66,108.46 10.41,99.06 10.16,105.41 12.95,105.16 16.76,83.06 67.56,88.39
  pour Bottom: 85.23,114.81 0.76,114.81 -2.29,111.76 -2.29,1.27 0.76,-1.78 85.23,-1.78
  pour Top: 85.74,114.81 -1.52,114.81 -4.06,112.27 -4.06,-3.03 85.74,-3.03
GP26
  Bottom 0.254: R4.2 D4.C 22.41,70.41 29.46,77.47 29.46,88.65 31.5,90.68 U3.P$31
GP27
  Bottom 0.254: R5.2 D5.C 17.47,71.63 22.35,71.63 28.45,77.72 28.45,90.17 31.5,93.22 U3.P$32
MISO  (via drill 0.3)
  Top 0.254: v75.18,100.84 v54.86,100.84
  Bottom 0.254: MICROSD.7 79.41,78.88 78.95,79.34 78.95,81.72 79.76,82.52 79.76,92.03 79.12,92.67 U4.2 79.12,96.9 v75.18,100.84 | U3.P$6 v54.86,100.84
MOSI  (via drill 0.3)
  Top 0.254: v73.25,103.38 v54.86,103.38
  Bottom 0.254: MICROSD.3 80.78,74.48 84.11,77.81 84.11,86.49 81.66,88.94 U4.5 81.66,92.32 82.24,92.9 82.24,97.03 75.9,103.38 v73.25,103.38 | U3.P$5 v54.86,103.38
MOSI1  (via drill 0.3)
  Top 0.254: v45.21,84.2 v19.81,84.2
  Bottom 0.254: U$2.14 19.04,84.73 19.57,84.2 v19.81,84.2 | v45.21,84.2 51.44,77.98 U3.P$15
N$1
  Bottom 0.203: R2.12 65.27,79.24 RATE1.1
N$2
  Bottom 0.254: D2.A 11.18,103.05 7.87,106.35 D3.C 4.96,106.5 C16.2
N$3
  Bottom 0.254: D1.A 14.48,102.78 13.01,101.31 10.36,101.31 9.36,102.31 9.36,103.61 8.77,104.21 C16.1 4.57,102.54 4.37,102.34 4.37,98.32 L1.P$2 5.36,98.27 7.62,96.01 Q2.3
N$4
  Bottom 0.203: R2.14 64.27,80.43 61.06,77.22 RATE2.1
PREVGH
  Bottom 0.254: D1.C 15.49,105.48 15.49,97.98 14.54,97.03 C15.1 14.54,95.08 13.67,94.2 13.67,91.97 15.75,89.89 15.75,82.3 16.81,81.23 U$2.21
PREVGL
  Bottom 0.254: D3.A 7.87,102.62 9.91,100.58 13.02,100.58 C14.1 13.64,98.16 13.64,94.75 13.26,94.37 13.26,91.8 15.34,89.72 15.34,82.13 17.24,80.23 U$2.23
PROG
  Bottom 0.203: R2.13 64.77,80.17 61.21,76.61 61.21,73.41 | 61.21,73.41 60.64,72.83 U2.5 | RATE1.2 62.99,75.18 61.21,73.41 | RATE2.2 59.44,75.18 61.21,73.41
RESE  (via drill 0.3)
  Top 0.254: v13.08,96.52 14.99,94.62 v14.99,91.44
  Bottom 0.254: R3.1 8.91,97.83 Q2.2 12.64,96.96 v13.08,96.52 | v14.99,91.44 16.19,90.23 U$2.3
RESET  (via drill 0.3)
  Top 0.254: v31.75,51.82 37.34,57.4 v37.34,62.99
  Bottom 0.254: RESET.P$2 3.37,23.44 v31.75,51.82 | v37.34,62.99 37.34,88.17 36.59,88.91 34.3,88.91 33.53,88.14 U3.P$30
RX/SCL  (via drill 0.3)
  Top 0.254: v61.72,80.01 49.53,67.82 v29.72,67.82 12.65,84.89 12.65,93.83 12.09,94.39 v12.09,108.46
  Bottom 0.203: v61.72,80.01 63.04,81.33 R2.16
  Bottom 0.254: I2C.4 16.05,54.15 v29.72,67.82 U3.P$22 | v12.09,108.46 8.89,108.46 6.35,111 JP1.3
SCK  (via drill 0.3)
  Top 0.254: v75.63,102.11 71.82,105.92 v54.86,105.92
  Bottom 0.254: MICROSD.5 81.03,76.68 81.65,77.3 81.65,87.66 80.39,88.92 U4.6 80.39,92.84 79.75,93.48 79.75,97.99 v75.63,102.11 | U3.P$4 v54.86,105.92
SCK1  (via drill 0.3)
  Top 0.254: v45.21,84.92 v19.81,84.92
  Bottom 0.254: U$2.13 19.25,85.23 19.56,84.92 v19.81,84.92 | v45.21,84.92 47.2,84.92 51.6,80.52 U3.P$14
SDCS  (via drill 0.3)
  Top 0.254: v54.86,98.3 69.56,98.3 72.75,95.1 72.75,84.44 v67.58,79.26
  Bottom 0.203: 66.31,80.53 66.27,80.53 65.77,81.03 R2.11
  Bottom 0.254: MICROSD.2 73.45,73.38 v67.58,79.26 66.31,80.53 | U3.P$7 v54.86,98.3
STAT  (via drill 0.3)
  Top 0.254: v59.7,110.47 60.74,110.47 61.5,109.7 69.11,109.7 76.2,102.62 76.2,85.09 v63.75,72.64
  Bottom 0.254: R1.8 59.42,110.19 v59.7,110.47 | v63.75,72.64 63.57,72.83 U2.1
STATMON
  Bottom 0.254: U3.P$34 43.94,98.3 46.51,100.86 46.51,103.43 50.31,107.23 55.2,107.23 57.34,109.37 R1.7 59.36,109.37 60.17,110.19 R1.1
TX/SDA  (via drill 0.3)
  Top 0.254: v63.37,80.26 48.39,65.28 v29.72,65.28 v24.38,65.28 11.82,77.84 11.82,93.2 11.18,93.85 11.18,111 JP1.1
  Bottom 0.203: v63.37,80.26 63.77,80.67 R2.15
  Bottom 0.254: v24.38,65.28 15.26,56.15 I2C.3 | U3.P$21 v29.72,65.28
V+  (via drill 0.3)
  Top 0.508: v64.52,113.03 51.82,113.03 v48.01,109.22
  Bottom 0.508: v64.52,113.03 C1.1 65.85,112.53 66.8,111.58 U1.5 | v48.01,109.22 47.78,108.99 37.82,108.99 35.81,111 U3.P$39 28.14,111 Q1.2
VBAT  (via drill 0.3)
  Top 0.508: v26.16,107.2 33.26,107.2 37.08,103.38 37.08,99.49 v57.33,79.25
  Bottom 0.508: C4.1 63.5,70.93 | 63.5,70.93 U2.3 61.62,70.93 60.68,71.87 59.37,71.87 57.33,73.91 v57.33,79.25 | BATTERY.2 64.5,64.02 63.5,65.02 63.5,70.93 | Q1.3 v26.16,107.2
VBUS  (via drill 0.3)
  Top 0.508: v37.85,110.74 38.69,109.9 38.69,101.16 v55.63,84.23
  Bottom 0.254: U3.P$40 27.94,113.54 24.45,110.05 Q1.1
  Bottom 0.508: U2.4 58.35,70.93 55.63,73.66 v55.63,84.23 | v37.85,110.74 35.05,113.54 U3.P$40
VCOM
  Bottom 0.254: C13.2 21.43,79.73 U$2.24
VDD
  Bottom 0.254: C10.2 21.84,82.73 U$2.18
VGH
  Bottom 0.254: C9.2 23.26,89.23 U$2.5
VGL
  Bottom 0.254: C8.2 21.22,89.73 U$2.4
VSH
  Bottom 0.254: C11.2 23.38,81.73 U$2.20
VSL
  Bottom 0.254: C12.2 22.96,80.73 U$2.22

### Text on the board
tPlace: Project info: | RX | GND | TX | 3V | https://github.com/joeycastillo/The-Open-Book/ | @josecastillo | ``Auntie, there's one thing I can't figure out." / / ``Only one?" She smiled and he smiled back. / / ``For now. When I bring a notepad to school, I can write / anything I want on it. I don't need to ask the company that / made the pen or the store that sold me the notebook how / I can use it. I can tear out the pages and make paper / airplanes, or doodle, or copy down what the teacher says. / When I put on a pair of shoes, I can wear any socks I want. / I can walk anywhere I want to go on my shoes. I can wipe / myself with any sort of toilet paper—" That got a laugh. / ``But I can't toast any bread I want in my toaster." / / She waited. He was struggling to find the words. ``What's / the question, Abdirahim?" / / He shook his head, shrugged. ``I guess I don't know. I just / want to understand, how can it be against the law to choose / your bread but not your socks? What makes a toaster / different from shoes?" / / She opened her mouth to answer, but discovered she didn't / know the answer. Right up until that moment she'd felt like / she had some intuitive sense of which things were objects- / with-rules and which ones were objects-without-rules, felt / it so readily that she hadn't even named the two categories / until just that instant. Now that she tried to come up with a / rule to explain the difference between the two, she found / she couldn't. / / ``That is an excellent question," she said at last. ``Why don't / you research the answer and tell us all what you find out." / / - From ``Unauthorized Bread" by Cory Doctorow | Abridged Edition | THE OPEN BOOK | OSO | OSO-BOOK-C1-00
bPlace: SERIAL / PORT | P-CHAN. / MOSFET | POWER / SUPPLY | RX | GND | TX | 3V | GP17 | GP16 | When USB power is / absent, lets current / flow from the Li-Ion / battery to VSYS to / power the device. | Two 3.3V power domains / for the Open Book's / main functionality and / external peripherals. / See below for more. | 4.2 INCH / E-PAPER / DISPLAY | Connects to Pico's / pin GP12 and has / an external 10KΩ / pullup resistor. You / can use this button / to wake up from the / DORMANT state. | LOCK / BUTTON | BABEL FLASH CHIP | A 2 MB Flash chip with room / for the glyphs of all human / languages in Unicode's / Basic Multilingual Plane, / using the Babel library. / On SPI0; chip select is GP1. | VARIOUS 10K / RESISTORS | MICROSD SLOT | For SPI µSD / cards. On SPI0 / and CS is GP5. | Battery chg / rate select / + various / pull-ups. | STEMMA/ / JST-PH / PORTS | GND | 3V | GP27 | BATTERY AND / CHARGING | THE OPEN BOOK IS / OPEN SOURCE HARDWARE! / CC-BY-SA 4.0 | RASPBERRY PI PICO | GND | PIN / DEFINITION | SUPPLEMENTAL INFORMATION | 3V | POWER SUPPLY: The Raspberry Pi Pico has its own / 3.3V buck/boost converter on board; it provides / power to the microcontroller. For peripherals, the / Open Book board has its own dual output regulator / U1 that provides 2 independent 3.3V power domains; / off by default, enable them with pins EN1 and EN2. / The EN1 domain powers the e-paper screen, Babel / Flash chip and MicroSD card, if inserted. EN2 powers / the STEMMA ports & the 3V to the serial port up top. | GP16 / SDA | Power: / GP0: EN1 / GP22: EN2 / *GP28: STAT/2 / SPI0: / GP1: Babel CS / GP2: SCK / GP3: MOSI / GP4: MISO / GP5: SD CS / EPD Screen: / GP6: Busy / GP7: Reset / GP8: D/C / GP9: CS / GP10: SCK1 / GP11: MOSI1 / Buttons: / GP12: Lock / GP13: Right / GP14: Select / GP15: Next / GP18: Prev / GP19: Up / GP20: Left / GP21: Down / I2C / UART: / GP16: SDA/TX / GP17: SCL/RX / STEMMA: / *GP26: A0 / *GP27: A1 / Internal: / GP23: PwrSave / GP24: Ext. Pwr / GP25: LED / *GP29: VSYS/3 / / * = Analog Pin | GP17 / SCL | GND | BATTERY: By default the battery charges at 100mA. / IF YOUR BATTERY SUPPORTS A FASTER RATE, you may / close one solder jumper to charge at 200mA or both / to charge at 300mA. Be absolutely sure your battery / supports the desired rate! Charging too fast can / damage the battery and cause overheating or fire. | 3V | GP26 | FIDUCIALS | RASPBERRY PI PICO: This module includes a dual core / ARM Cortex M0+ microcontroller with 264 kB of SRAM / and 2MB of QSPI Flash (the CIRCUITPY drive, when / using the board with CircuitPython). Every pin has / a purpose; check PIN DEFINITION to see what's what. | These tiny dots strewn / around the board are / there to help automated / pick and place / machines when / assembling boards. The / machine can use the / dot's position to place / parts more accurately. | v v v v v v v v v v v v v v v v v v v v v v | SAFE AREA FOR 4.2V LI-ION BATTERY | POWER MONITORS: The Pi Pico's GP24 pin senses the / presence of USB power; if high, we're plugged in. / GP29 is Pico's VSYS voltage divided by 3. When not / on USB power, you can use this to roughly measure / battery voltage. In addition to pulling down EN1 and / EN2, R1 divides the battery charger's STAT pin by 2 / to read charging status on GP28. At 2.5V the battery / is charging; at 0V it is either full (if VBUS is / present) or discharging (if VBUS is not present). | THE OPEN | RESET / BUTTON | BOOK | Shorts RPi's RUN / pin to GND when / pressed. This / resets the / microconrtroller. | Abridged / Edition | FRONT BUTTONS AND JOYSTICK: All these inputs are / active low and require an internal pull-up. | SERIAL PORT: The UART0 peripheral. Shares pins with / the STEMMA I2C port. 3V pin powered by EN2 domain. | ENABLE / SWITCH | The Open Book, by Joey / Castillo @josecastillo. / Crafted with . in BK, NY. / With thanks to @Adafruit / for their awesome open / source designs! Lazer bear / artwork by Joseph Devens, / @DoctorDevens. Please / don't steal the bear. / The Open Book Abridged / Edition is a simplified / version of the Open Book, / optimized for lower cost / and easier manufacturing. / Feel free to fork it and / make it your own! | STEMMA PORTS: GP26 and GP27 pins are available as / STEMMA-compatible ports; they can be digital inputs / or outputs, analog inputs, or PWM outputs (GP27 can / also act as a PWM input for frequency & duty cycle / measurement). A current limiting resistor lets you / run an LED from the output, and 3.6V zener diodes / provide some protection from higher voltage inputs. / The I²C port in the center uses the same pins as / the Serial Port up top; you should only use one or / the other at a time. All these ports are powered off / by default; you must set EN2 high to power them. | Connects the / 3V3_EN pin / to GND, dis- / abling Pico's / on-board / regulator. Since / EN1 & EN2 pins / are pulled down, / this also cuts / power to our / E-Paper screen / & peripherals.
tStop: THE OPEN BOOK
bDocu: 306070 1800 mAh battery / https://www.aliexpress.com/item/32927730430.html | 505060 2000mAh battery / https://www.aliexpress.com/item/32909666222.html | 785060 2500 mAh battery / https://adafru.it/2011 / / WARNING: Thick at ~7.2mm | 494251 1500 mAh battery / https://www.aliexpress.com/item/33046960888.html | 803860 2000 mAh battery / https://adafru.it/2011 / / WARNING: Thick at ~7.5mm